# Altium schematic sheet BMS-S02-V01-CellMonitor.SchDoc: Cell Monitor
size A3; DrawnBy: Sam Haines; DocumentNumber: 5; Revision: 01; SheetNumber: 5; SheetTotal: 10; Version: 01; Project: Battery Managment System 2020; PageSetup: Record=PageOptions|CenterHorizontal=True|CenterVertical=True|PrintScale=0.97|XCorrection=1.00|YCorrection=1.00|PrintKind=0|BorderSize=5000000|LeftOffset=0|BottomOffset=0|Orientation=2|PaperLength=1000|PaperWidth=1000|Scale=100|PaperSource=7|PrintQuality=-4|MediaType=1|DitherType=10|PaperKind=A4|PrintScaleMode=1
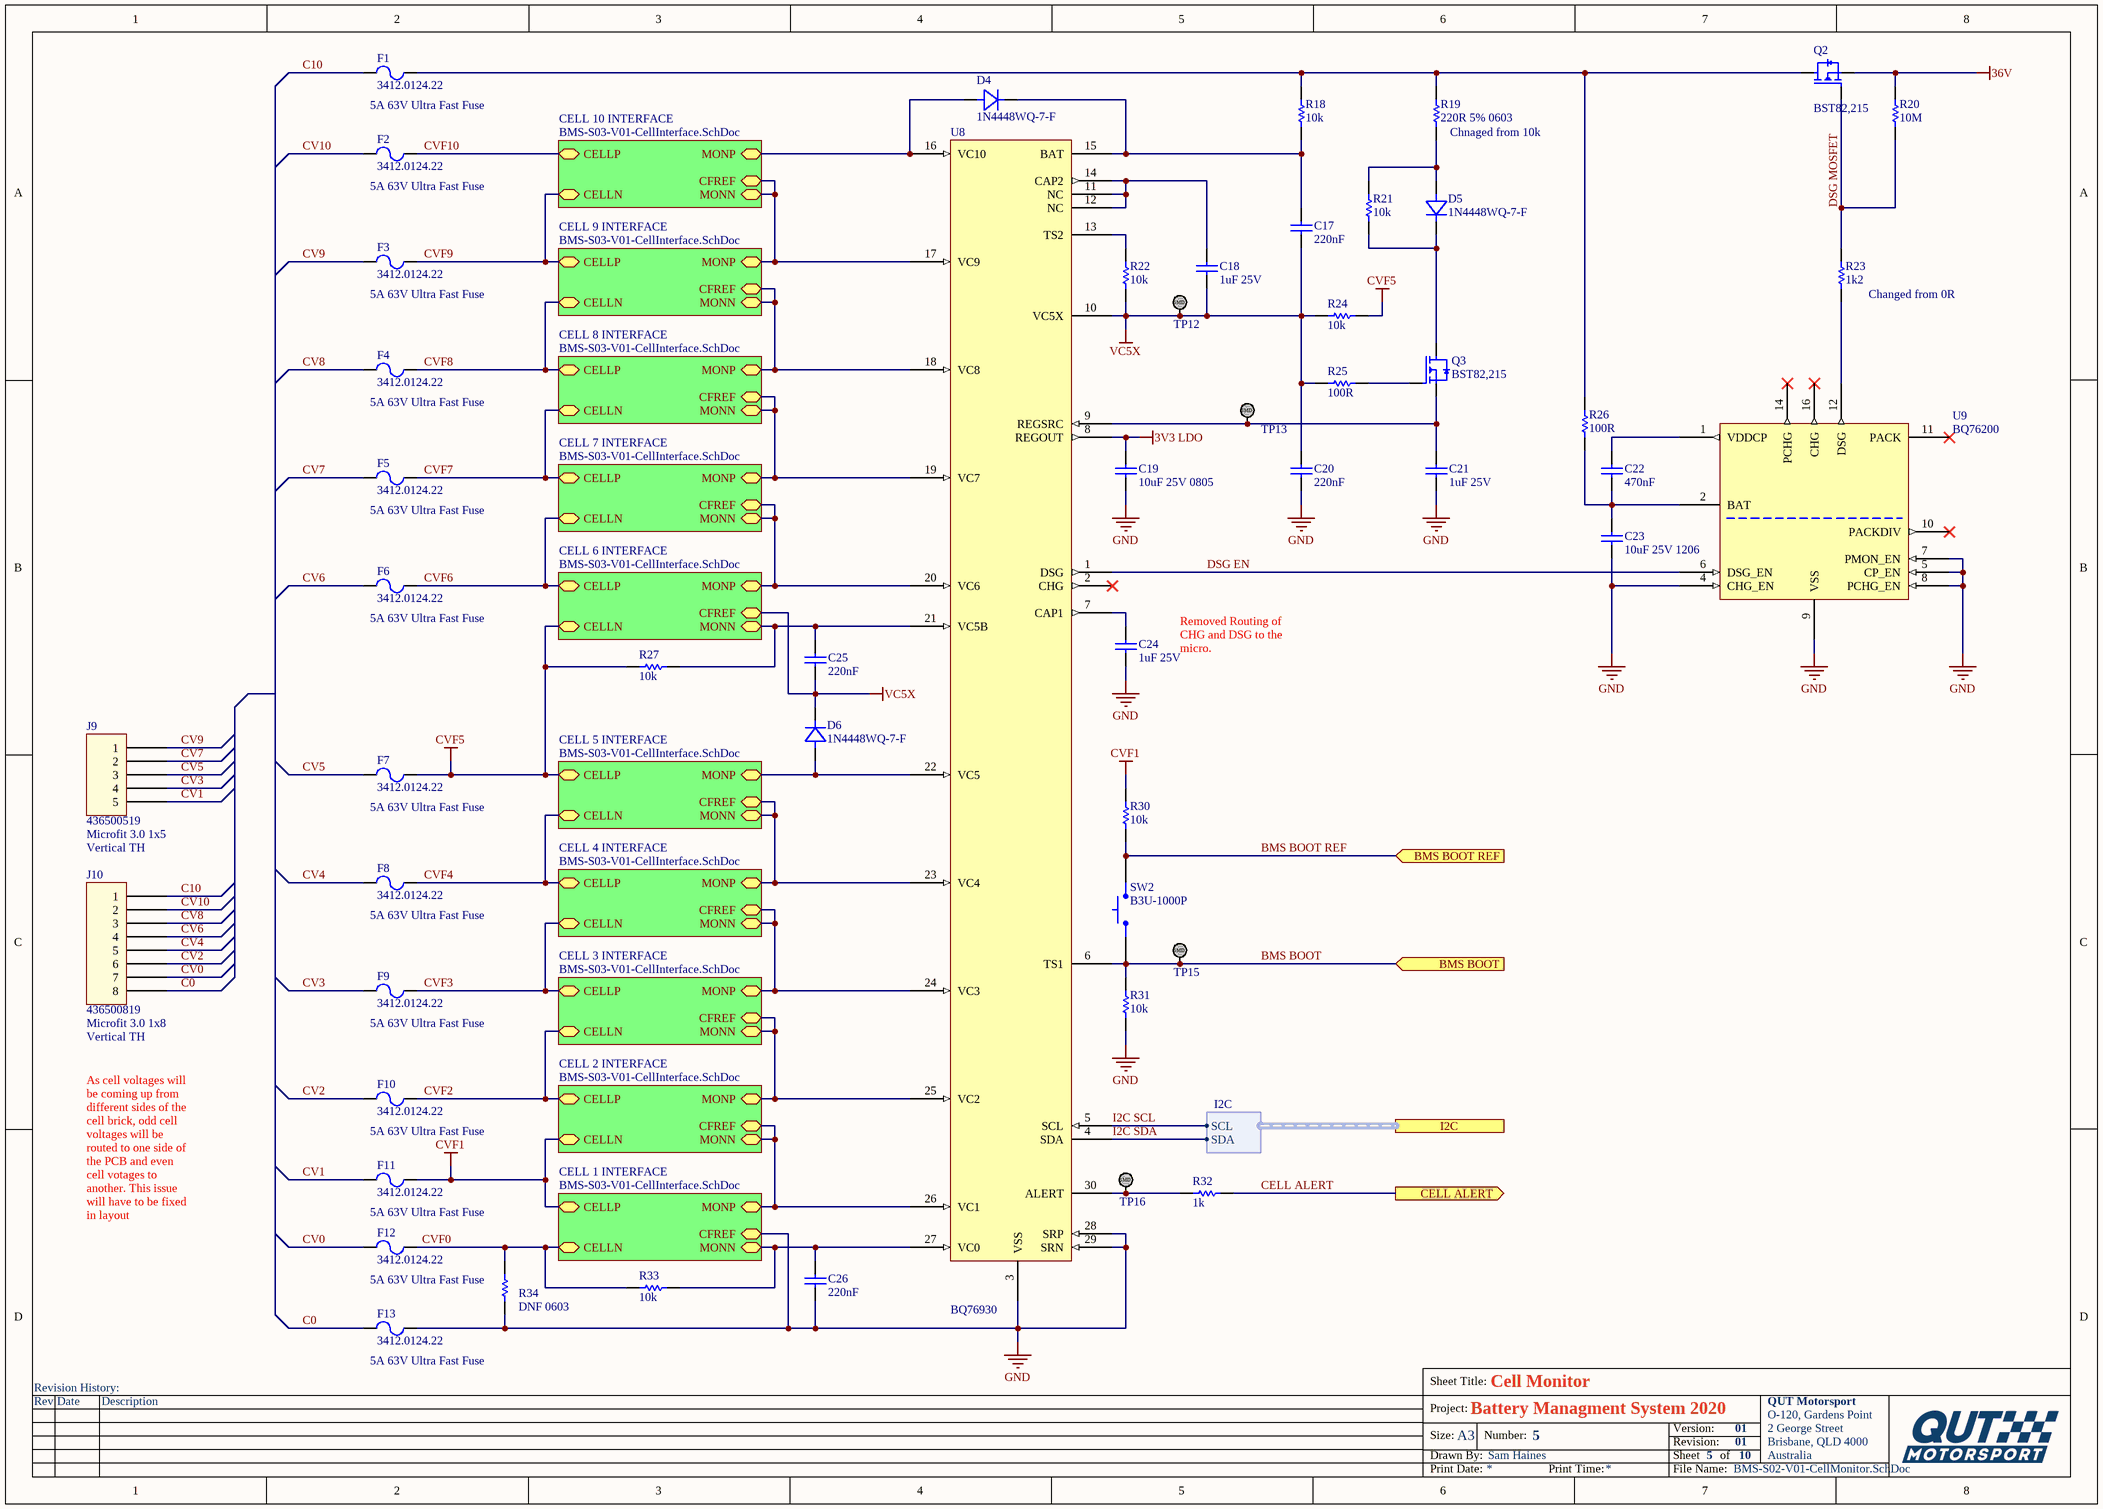
[diagram p0: BMS-S02-V01-CellMonitor.SchDoc]

## Parts
C17  220nF  [Cap_Ceramic_0603]
C18  1uF 25V  [Cap_Ceramic_0603]
C19  10uF 25V 0805  [Cap_Ceramic_0805]
C20  220nF  [Cap_Ceramic_0603]
C21  1uF 25V  [Cap_Ceramic_0603]
C22  470nF  [Cap_Ceramic_0603]
C23  10uF 25V 1206  [Cap_Ceramic_1206]
C24  1uF 25V  [Cap_Ceramic_0603]
C25  220nF  [Cap_Ceramic_0603]
C26  220nF  [Cap_Ceramic_0603]
D4  1N4448WQ-7-F  [SMA]
D5  1N4448WQ-7-F  [SMA]
D6  1N4448WQ-7-F  [SMA]
F1  3412.0124.22  [3412.0124.22]
F2  3412.0124.22  [3412.0124.22]
F3  3412.0124.22  [3412.0124.22]
F4  3412.0124.22  [3412.0124.22]
F5  3412.0124.22  [3412.0124.22]
F6  3412.0124.22  [3412.0124.22]
F7  3412.0124.22  [3412.0124.22]
F8  3412.0124.22  [3412.0124.22]
F9  3412.0124.22  [3412.0124.22]
F10  3412.0124.22  [3412.0124.22]
F11  3412.0124.22  [3412.0124.22]
F12  3412.0124.22  [3412.0124.22]
F13  3412.0124.22  [3412.0124.22]
J9  436500519  [Microfit_1X5_V_TH]
J10  436500819  [Microfit_1X8_V_TH]
Q2  BST82,215  [BST82,215]
Q3  BST82,215  [BST82,215]
R18  10k  [Res_ThinFilm_0603]
R19  220R 5% 0603  [Res_ThinFilm_0603]
R20  10M  [Res_ThinFilm_0603]
R21  10k  [Res_ThinFilm_0603]
R22  10k  [Res_ThinFilm_0603]
R23  1k2  [Res_ThinFilm_0603]
R24  10k  [Res_ThinFilm_0603]
R25  100R  [Res_ThinFilm_0603]
R26  100R  [Res_ThinFilm_0603]
R27  10k  [Res_ThinFilm_0603]
R30  10k  [Res_ThinFilm_0603]
R31  10k  [Res_ThinFilm_0603]
R32  1k  [Res_ThinFilm_0603]
R33  10k  [Res_ThinFilm_0603]
R34  DNF 0603  [Res_ThinFilm_0603]
SW2  B3U-1000P  [BTN B3U-1000P]
TP12  TestPoint_SMD  [TestPointSMD]  (value not drawn)
TP13  TestPoint_SMD  [TestPointSMD]  (value not drawn)
TP15  TestPoint_SMD  [TestPointSMD]  (value not drawn)
TP16  TestPoint_SMD  [TestPointSMD]  (value not drawn)
U8  BQ76930  [bq76930]
U9  BQ76200  [BQ76200]

## Sub-sheets
CELL 1 INTERFACE = BMS-S03-V01-CellInterface.SchDoc: CFREF (bidir), MONP (bidir), MONN (bidir), CELLP (bidir), CELLN (bidir)
CELL 2 INTERFACE = BMS-S03-V01-CellInterface.SchDoc: CFREF (bidir), MONP (bidir), MONN (bidir), CELLP (bidir), CELLN (bidir)
CELL 3 INTERFACE = BMS-S03-V01-CellInterface.SchDoc: CFREF (bidir), MONP (bidir), MONN (bidir), CELLP (bidir), CELLN (bidir)
CELL 4 INTERFACE = BMS-S03-V01-CellInterface.SchDoc: CFREF (bidir), MONP (bidir), MONN (bidir), CELLP (bidir), CELLN (bidir)
CELL 5 INTERFACE = BMS-S03-V01-CellInterface.SchDoc: CFREF (bidir), MONP (bidir), MONN (bidir), CELLP (bidir), CELLN (bidir)
CELL 6 INTERFACE = BMS-S03-V01-CellInterface.SchDoc: CFREF (bidir), MONP (bidir), MONN (bidir), CELLP (bidir), CELLN (bidir)
CELL 7 INTERFACE = BMS-S03-V01-CellInterface.SchDoc: CFREF (bidir), MONP (bidir), MONN (bidir), CELLP (bidir), CELLN (bidir)
CELL 8 INTERFACE = BMS-S03-V01-CellInterface.SchDoc: CFREF (bidir), MONP (bidir), MONN (bidir), CELLP (bidir), CELLN (bidir)
CELL 9 INTERFACE = BMS-S03-V01-CellInterface.SchDoc: CFREF (bidir), MONP (bidir), MONN (bidir), CELLP (bidir), CELLN (bidir)
CELL 10 INTERFACE = BMS-S03-V01-CellInterface.SchDoc: CFREF (bidir), MONP (bidir), MONN (bidir), CELLP (bidir), CELLN (bidir)

## Ports
BMS BOOT (in), BMS BOOT REF (in), CELL ALERT (out), I2C (harness I2C)

## Harnesses
I2C: SDA, SCL

## Nets
3V3 LDO: C19.2 U8.8(REGOUT)
36V: Q2.S(Source) R20.2
CVF1: F11.2 R30.2 ; sheet CELL 1 INTERFACE/CELLP, sheet CELL 2 INTERFACE/CELLN
CVF5: F7.2 R24.2 R27.1 ; sheet CELL 5 INTERFACE/CELLP, sheet CELL 6 INTERFACE/CELLN
GND: C19.1 C20.1 C21.1 C23.1 C24.1 C26.1 F13.2 R31.1 R34.1 U8.3(VSS) U8.28(SRP) U8.29(SRN) U9.4(CHG_EN) U9.5(CP_EN) U9.7(PMON_EN) U9.8(PCHG_EN) U9.9(VSS) ; sheet CELL 1 INTERFACE/CFREF
VC5X: C17.1 C18.1 C20.2 C25.1 D6.K(Cathode) R22.1 R24.1 R25.2 TP12.1 U8.10(VC5X) ; sheet CELL 6 INTERFACE/CFREF
BMS BOOT: R31.2 SW2.1 TP15.1 U8.6(TS1) ; port BMS BOOT
BMS BOOT REF: R30.1 SW2.2 ; port BMS BOOT REF
C0: F13.1 J10.8
C10: F1.1 J10.1
CELL ALERT: R32.2 ; port CELL ALERT
CV0: F12.1 J10.7
CV1: F11.1 J9.5
CV2: F10.1 J10.6
CV3: F9.1 J9.4
CV4: F8.1 J10.5
CV5: F7.1 J9.3
CV6: F6.1 J10.4
CV7: F5.1 J9.2
CV8: F4.1 J10.3
CV9: F3.1 J9.1
CV10: F2.1 J10.2
CVF0: F12.2 R33.1 R34.2 ; sheet CELL 1 INTERFACE/CELLN
CVF2: F10.2 ; sheet CELL 2 INTERFACE/CELLP, sheet CELL 3 INTERFACE/CELLN
CVF3: F9.2 ; sheet CELL 3 INTERFACE/CELLP, sheet CELL 4 INTERFACE/CELLN
CVF4: F8.2 ; sheet CELL 4 INTERFACE/CELLP, sheet CELL 5 INTERFACE/CELLN
CVF6: F6.2 ; sheet CELL 6 INTERFACE/CELLP, sheet CELL 7 INTERFACE/CELLN
CVF7: F5.2 ; sheet CELL 7 INTERFACE/CELLP, sheet CELL 8 INTERFACE/CELLN
CVF8: F4.2 ; sheet CELL 8 INTERFACE/CELLP, sheet CELL 9 INTERFACE/CELLN
CVF9: F3.2 ; sheet CELL 10 INTERFACE/CELLN, sheet CELL 9 INTERFACE/CELLP
CVF10: F2.2 ; sheet CELL 10 INTERFACE/CELLP
DSG EN: U8.1(DSG) U9.6(DSG_EN)
DSG MOSFET: Q2.G(Gate) R20.1 R23.2
I2C SCL: U8.5(SCL) ; port I2C.SCL
I2C SDA: U8.4(SDA) ; port I2C.SDA
NetC17_2: C17.2 D4.K(Cathode) R18.1 U8.15(BAT)
NetC18_2: C18.2 U8.11(NC) U8.12(NC) U8.14(CAP2)
NetC21_2: C21.2 Q3.S(Source) TP13.1 U8.9(REGSRC)
NetC22_1: C22.1 C23.2 R26.1 U9.2(BAT)
NetC22_2: C22.2 U9.1(VDDCP)
NetC24_2: C24.2 U8.7(CAP1)
NetC25_2: C25.2 R27.2 U8.21(VC5B) ; sheet CELL 6 INTERFACE/MONN
NetC26_2: C26.2 R33.2 U8.27(VC0) ; sheet CELL 1 INTERFACE/MONN
NetD4_A: D4.A(Anode) U8.16(VC10) ; sheet CELL 10 INTERFACE/MONP
NetD5_A: D5.A(Anode) R19.1 R21.2
NetD5_K: D5.K(Cathode) Q3.D(Drain) R21.1
NetD6_A: D6.A(Anode) U8.22(VC5) ; sheet CELL 5 INTERFACE/MONP
NetF1_2: F1.2 Q2.D(Drain) R18.2 R19.2 R26.2
NetQ3_G: Q3.G(Gate) R25.1
NetR22_2: R22.2 U8.13(TS2)
NetR23_1: R23.1 U9.12(DSG)
NetR32_1: R32.1 TP16.1 U8.30(ALERT)
NetU8_17: U8.17(VC9) ; sheet CELL 10 INTERFACE/CFREF, sheet CELL 10 INTERFACE/MONN, sheet CELL 9 INTERFACE/MONP
NetU8_18: U8.18(VC8) ; sheet CELL 8 INTERFACE/MONP, sheet CELL 9 INTERFACE/CFREF, sheet CELL 9 INTERFACE/MONN
NetU8_19: U8.19(VC7) ; sheet CELL 7 INTERFACE/MONP, sheet CELL 8 INTERFACE/CFREF, sheet CELL 8 INTERFACE/MONN
NetU8_20: U8.20(VC6) ; sheet CELL 6 INTERFACE/MONP, sheet CELL 7 INTERFACE/CFREF, sheet CELL 7 INTERFACE/MONN
NetU8_23: U8.23(VC4) ; sheet CELL 4 INTERFACE/MONP, sheet CELL 5 INTERFACE/CFREF, sheet CELL 5 INTERFACE/MONN
NetU8_24: U8.24(VC3) ; sheet CELL 3 INTERFACE/MONP, sheet CELL 4 INTERFACE/CFREF, sheet CELL 4 INTERFACE/MONN
NetU8_25: U8.25(VC2) ; sheet CELL 2 INTERFACE/MONP, sheet CELL 3 INTERFACE/CFREF, sheet CELL 3 INTERFACE/MONN
NetU8_26: U8.26(VC1) ; sheet CELL 1 INTERFACE/MONP, sheet CELL 2 INTERFACE/CFREF, sheet CELL 2 INTERFACE/MONN

Not connected (* = marked no-connect by the designer): U8 2(CHG)*; U9 10(PACKDIV)* 11(PACK)* 14(PCHG)* 16(CHG)*

## Notes on the sheet
- 5A 63V Ultra Fast Fuse
- (near R19) Chnaged from 10k
- (near F2) 5A 63V Ultra Fast Fuse
- (near F3) 5A 63V Ultra Fast Fuse
- (near R23) Changed from 0R
- (near F4) 5A 63V Ultra Fast Fuse
- (near F5) 5A 63V Ultra Fast Fuse
- (near F6) 5A 63V Ultra Fast Fuse
- Removed Routing of CHG and DSG to the micro.
- (near J9) Microfit 3.0 1x5
- Vertical TH
- (near F7) 5A 63V Ultra Fast Fuse
- (near F8) 5A 63V Ultra Fast Fuse
- (near J10) Microfit 3.0 1x8
- (near J10) Vertical TH
- (near F9) 5A 63V Ultra Fast Fuse
- As cell voltages will be coming up from different sides of the cell brick, odd cell voltages will be routed to one side of the PCB and even cell votages to another. This issue will have to be fixed in layout
- (near R34) 5A 63V Ultra Fast Fuse
- (near F13) 5A 63V Ultra Fast Fuse
- Revision History:
- Sheet Title:
- Rev
- Date
- Description
- Project:
- Size:
- Drawn By:
- A3
- Number:
- Revision:
- Sheet
- Version:
- of
- QUT Motorsport
- O-120, Gardens Point
- 2 George Street
- Brisbane, QLD 4000
- Australia
- Print Date:
- Print Time:
- File Name:
- (in symbol TestPoint_SMD) SMD

## Library data of the parts
C17 C20 C25 C26 = 220nF 50V 5% X7R 0603: Capacitor, Ceramic, SMD, 220nF, 50V, 5%, X7R, 0603
C18 C21 C24 = 1uF 25V 5% X7R 0603: Capacitor, Ceramic, SMD, 1uF, 25V, 5%, X7R, 0603
C19 = 10uF 25V 5% X7R 0805_1: Capacitor, Ceramic, SMD, 10uF, 25V, 5%, X7R, 0805
C22 = 470nF 50V 5% X7R 0603: Capacitor, Ceramic, SMD, 470nF, 50V, 5%, X7R, 0603
C23 = 10uF 25V 10% X7R 1206: Capacitor, Ceramic, SMD, 10uF, 25V, 10%, X7R, 1206
D4-D6 = 1N4448WQ-7-F: Diode, SMD, 75V, 5%, 250mA, SOD123; Manufacturer: ON Semiconductor / Fairchild; Manufacturer Part Number: 1N914BWS; Average Rectified Current: 150mA; Element Configuration: Single; Forward Voltage: 1V; Max Reverse Leakage Current: 5uA; Power Dissipation: 200mW; Recovery Time: 4ns; Max Forward Surge Current (Ifsm): 4A; Parameter 1: *; Weight: 0.0276g; Category: Rectifier Diodes; Contact Plating: Tin,Matte; Forward Current: 150mA; Lead Free: Lead Free; Max Operating Temperature: 150°C; Max Repetitive Reverse Voltage (Vrrm): 75V; Max Reverse Voltage (DC): 75V; Min Operating Temperature: -55°C; Mount: Surface Mount; Number of Pins: 2; Package Quantity: 1; Packaging: Tape and Reel; Peak Reverse Current: 5uA; Radiation Hardening: No; REACH SVHC: No SVHC; Reverse Recovery Time: 4ns; Height: 1mm; Length: 1.8mm; Reverse Voltage: 75V; Width: 1.35mm
F1-F13 = 3412.0124.22: FUSE BOARD MOUNT 5A 63VDC 0603
J9 = Microfit_1x5
J10 = Microfit_1x8
Q2 = BST82,215: MOSFET N-CH, 20V, SOT23 / Alternate Part / 2N7002LT1G0SCT-ND /
Q3 = BST82,215: MOSFET N-CH, 20V, SOT23
R18 R21 R22 R24 R27 R30 R31 R33 = 10k 5% 0603: Resistor, SMD, 10k, 0.1W, 5%, 0603
R19 = 470R 5% 0603: Resistor, SMD, 220R, 0.1W, 5%, 0603
R20 = 10M 5% 0603: Resistor, SMD, 10M, 0.1W, 5%, 0603
R23 = 0R 5% 0603: Resistor, SMD, 1k2R, 0.1W, 5%, 0603
R25 R26 = 100R 5%, 0603: Resistor, SMD, 100R, 0.1W, 5%, 0603
R32 = 1k 5% 0603: Resistor, SMD, 1k, 0.1W, 5%, 0603
R34 = DNF 0603: Resistor, SMD, DNF, 0.1W, 0603
SW2 = BTN B3U-1000P: Omron B3U-1000P Ultra Miniture Switch; ComponentLink1Description: LCSC; ComponentLink1URL: https://lcsc.com/product-detail/Tactile-Switches_BRIGHT-TSA063G50-250_C294565.html
U8 = BQ76930: Battery Monitoring/Fuel Gauge Li-Ion/Li-Polymer/LiFePO4 0V to 16V 30-Pin TSSOP T/R; InternalPart: Test1234; Manufacturer: Texas Instruments; Manufacturer Part Number: BQ7693003DBTR; Operating Supply Voltage: 25V; Interface: I2C; Fault Protection: Over Current,Short Circuit,Over/Under Voltage; Supplier 1: Digi-Key; RoHS: Yes; Category: Battery Management; Stock 1: 4521; Pricing 1: 1=4.66000, 10=4.18900, 25=3.96000, 100=3.25600, 250=2.92160, 500=2.81600, 1000=2.34080 (USD); Mount: Surface Mount; Case/Package: TFSOP; Number of Pins: 30; Weight: 0.003439oz; Contact Plating: Gold; Min Operating Temperature: -40°C; Max Operating Temperature: 85°C; Output Voltage: 16V; Packaging: Tape and Reel; Package Quantity: 2000; Lead Free: Lead Free; ComponentLink1URL: http://www.ti.com/lit/gpn/bq76930?src-supplier=Mouser; ComponentLink1Description: http://www.ti.com/lit/gpn/bq76930?src-supplier=Mouser; ComponentLink2URL: http://www.ti.com/lit/ds/symlink/bq76930.pdf?src-supplier=Digi-Key; ComponentLink2Description: http://www.ti.com/lit/ds/symlink/bq76930.pdf?src-supplier=Digi-Key; ComponentLink3URL: http://www.ti.com/lit/pdf/slpt038?src-supplier=Digi-Key; ComponentLink3Description: http://www.ti.com/lit/pdf/slpt038?src-supplier=Digi-Key; ComponentLink4URL: http://www.ti.com/general/docs/lit/getliterature.tsp?genericPartNumber=BQ76920&amp;&amp;fileType=pdf&src-supplier=Avnet+Asia; ComponentLink4Description: http://www.ti.com/general/docs/lit/getliterature.tsp?genericPartNumber=BQ76920&amp;&amp;fileType=pdf&src-supplier=Avnet+Asia; ComponentLink5URL: http://www.ti.com/general/docs/lit/getliterature.tsp?genericPartNumber=BQ76920&&fileType=pdf&src-supplier=Avnet; ComponentLink5Description: http://www.ti.com/general/docs/lit/getliterature.tsp?genericPartNumber=BQ76920&&fileType=pdf&src-supplier=Avnet; Supplier Part Number 1: 296-39961-1-ND
U9 = BQ76200PWR: High-voltage battery pack front-end charge/discharge high-side NFET driver; Manufacturer: Texas Instruments; MPN: BQ76200PWR